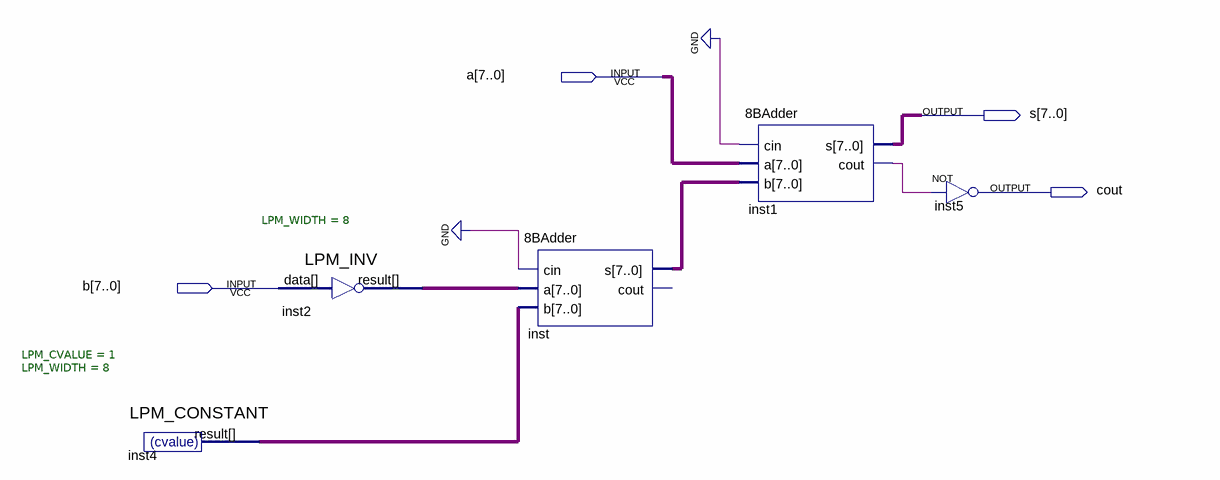
[diagram p0: schematic sheet]
// Quartus schematic 8BSub.bdf as structural Verilog: 5 symbols, 4 pins
module \8BSub  (
  input  [7:0] a,
  input  [7:0] b,
  output [7:0] s,
  output cout
);

  wire inst1_cout;
  wire [7:0] inst2_result, inst4_result, inst_s;

  LPM_CONSTANT #(.LPM_CVALUE(1), .LPM_WIDTH(8)) inst4 (.result(inst4_result));
  LPM_INV #(.LPM_WIDTH(8)) inst2 (.data(b), .result(inst2_result));
  \8BAdder  inst (.cin(1'b0), .a(inst2_result), .b(inst4_result), .s(inst_s));  // open: cout
  \8BAdder  inst1 (.cin(1'b0), .a(a), .b(inst_s), .s(s), .cout(inst1_cout));
  not inst5 (cout, inst1_cout);
endmodule
